# Altium schematic sheet eeprom_temp_sens.SchDoc: foxBMS BMS-Slave 12-Cell
size A3; DocumentNumber: 9; SheetNumber: 9; SheetTotal: 15; AUTHOR: Fraunhofer IISB foxBMS Team; SheetDescription: Primary EEPROM and Board T-Sensor
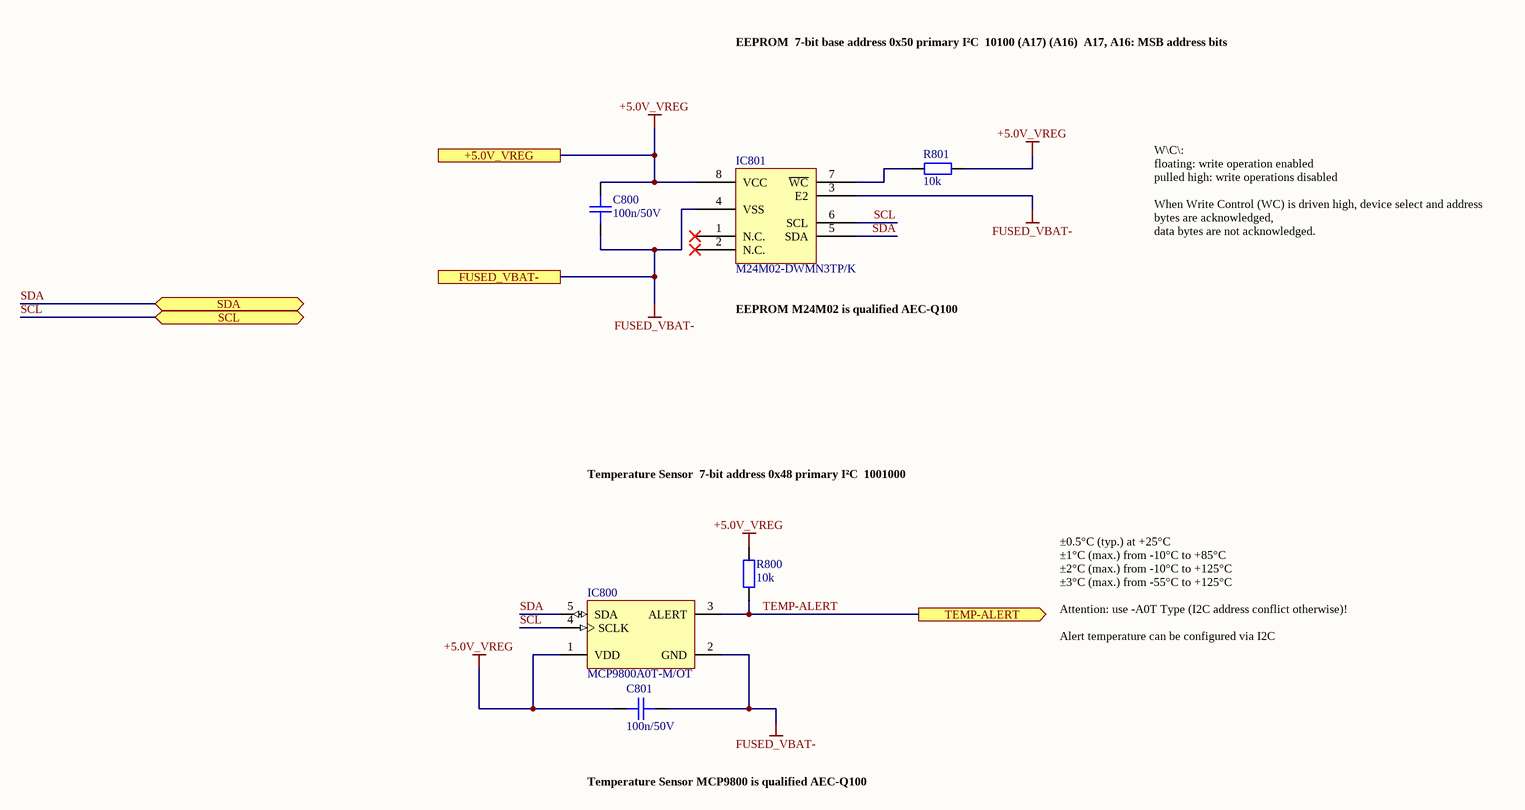
[diagram p0: eeprom_temp_sens.SchDoc]

## Parts
C800  100n/50V  [CAPC1608X08N]
C801  100n/50V  [CAPC1608X08N]
IC800  MCP9800A0T-M/OT  [SOT-23-OT5_L]
IC801  M24M02-DWMN3TP/K  [SOIC127P600X175-8N]
R800  10k  [RESC1608X05N]
R801  10k  [RESC1608X05N]

## Ports
+5.0V_VREG, FUSED_VBAT-, SCL (bidir), SDA (bidir), TEMP-ALERT (out)

## Nets
+5.0V_VREG: C800.2 C801.2 IC800.1(VDD) IC801.8(VCC) R800.2 R801.2 ; port +5.0V_VREG
FUSED_VBAT-: C800.1 C801.1 IC800.2(GND) IC801.3(E2) IC801.4(VSS) ; port FUSED_VBAT-
SCL: IC800.4(SCLK) IC801.6(SCL) ; port SCL
SDA: IC800.5(SDA) IC801.5(SDA) ; port SDA
TEMP-ALERT: IC800.3(ALERT) R800.1 ; port TEMP-ALERT
NetIC801_7: IC801.7(~{WC}) R801.1

Not connected (* = marked no-connect by the designer): IC801 1(N.C.)* 2(N.C.)*

## Notes on the sheet
- EEPROM
  7-bit base address 0x50 primary I²C
  10100 (A17) (A16)
  A17, A16: MSB address bits
- W\C\:
  floating: write operation enabled
  pulled high: write operations disabled
  When Write Control (WC) is driven high, device select and address bytes are acknowledged,
  data bytes are not acknowledged.
- EEPROM M24M02 is qualified AEC-Q100
- Temperature Sensor
  7-bit address 0x48 primary I²C
  1001000
- ±0.5°C (typ.) at +25°C
  ±1°C (max.) from -10°C to +85°C
  ±2°C (max.) from -10°C to +125°C
  ±3°C (max.) from -55°C to +125°C
  Attention: use -A0T Type (I2C address conflict otherwise)!
  Alert temperature can be configured via I2C
- Temperature Sensor MCP9800 is qualified AEC-Q100
- Fraunhofer IISB
- Schottkystr. 10
- developed by:
- 91058 Erlangen
- Germany
- Author
- Project
- License
- Description
- File
- Version
- Release Date
- Sheet
- www.foxbms.org
- www.iisb.fraunhofer.de
- foxBMS Team
- /

## Library data of the parts
C800 C801 = gen_C_ceramic_100n_50V_X7R_0603: MLCC; Capacitance: 100n; Rated Voltage: 50V; Dielectric: X7R; Case EIA: 0603; Case Metric: 1608; PnP Package: C_0603_10; PnP Value: 100n/50V/X7R; PnP equipped: x; Automotive Qualified: True; Part Number: gen_C_ceramic_100n_50V_X7R_0603; Supplier 1: Farnell; Supplier Part Number 1: 2525267; Supplier 2: Digikey; Supplier Part Number 2: 490-6049-1-ND; Supplier 3: Farnell; Supplier Part Number 3: 2070398
IC800 = CMP-0192-00211-1: 2-Wire High-Accuracy Temperature Sensor, Slave Address 000, 5-Pin SOT-23, -55°C to +125°C Temperature, Tape and Reel; PackageReference: SOT-23-OT5; PackageVersion: revBB, Aug-2009; DatasheetVersion: revD, Nov-2010; PackageDescription: 5-Lead Plastic Small Outline Transistor (OT) [SOT-23]; Code_IPC: SOT23-5
IC801 = M24M02-DWMN3TP/K: Automotive 2-Mbit serial I²C / bus EEPROM with 1 MHz clock; Manufacturer: STMicroelectronics; PnP Package: SO8N; Automotive Qualified: True; Part Number: M24M02-DWMN3TP/K; Part Name: M24M02-DWMN3TP/K; Operating Temperature: -40°C - +125°C; ComponentLink1Description: Datasheet; ComponentLink1URL: http://www.st.com/content/ccc/resource/technical/document/datasheet/83/f4/3e/e4/4e/49/42/c5/DM00200595.pdf/files/DM00200595.pdf/jcr:content/translations/en.DM00200595.pdf; Supplier 1: Digikey; Supplier Part Number 1: 497-16238-1-ND; Supplier 2: Mouser; Supplier Part Number 2: 511-M24M02-DWMN3TP/K; Supplier 3: Farnell; Supplier Part Number 3: 2849971
R800 R801 = gen_R_10k_0603: SMD Resistor 10k 0603; Tolerance: 1%; Power: 0.1W; Case EIA: 0603; Case Metric: 1608; Maximum Working Voltage: 75V; PnP Package: R_0603; Automotive Qualified: True; Part Number: gen_R_10k_0603; Operating Temperature: -55°C - +155°C; Resistance: 10k; Series: E24, E96; PnP Value: 10k; Supplier 1: Farnell; Supplier Part Number 1: 2073349